# EAGLE design MTX_pic_piggyback_V13 (EAGLE 7.5.0)
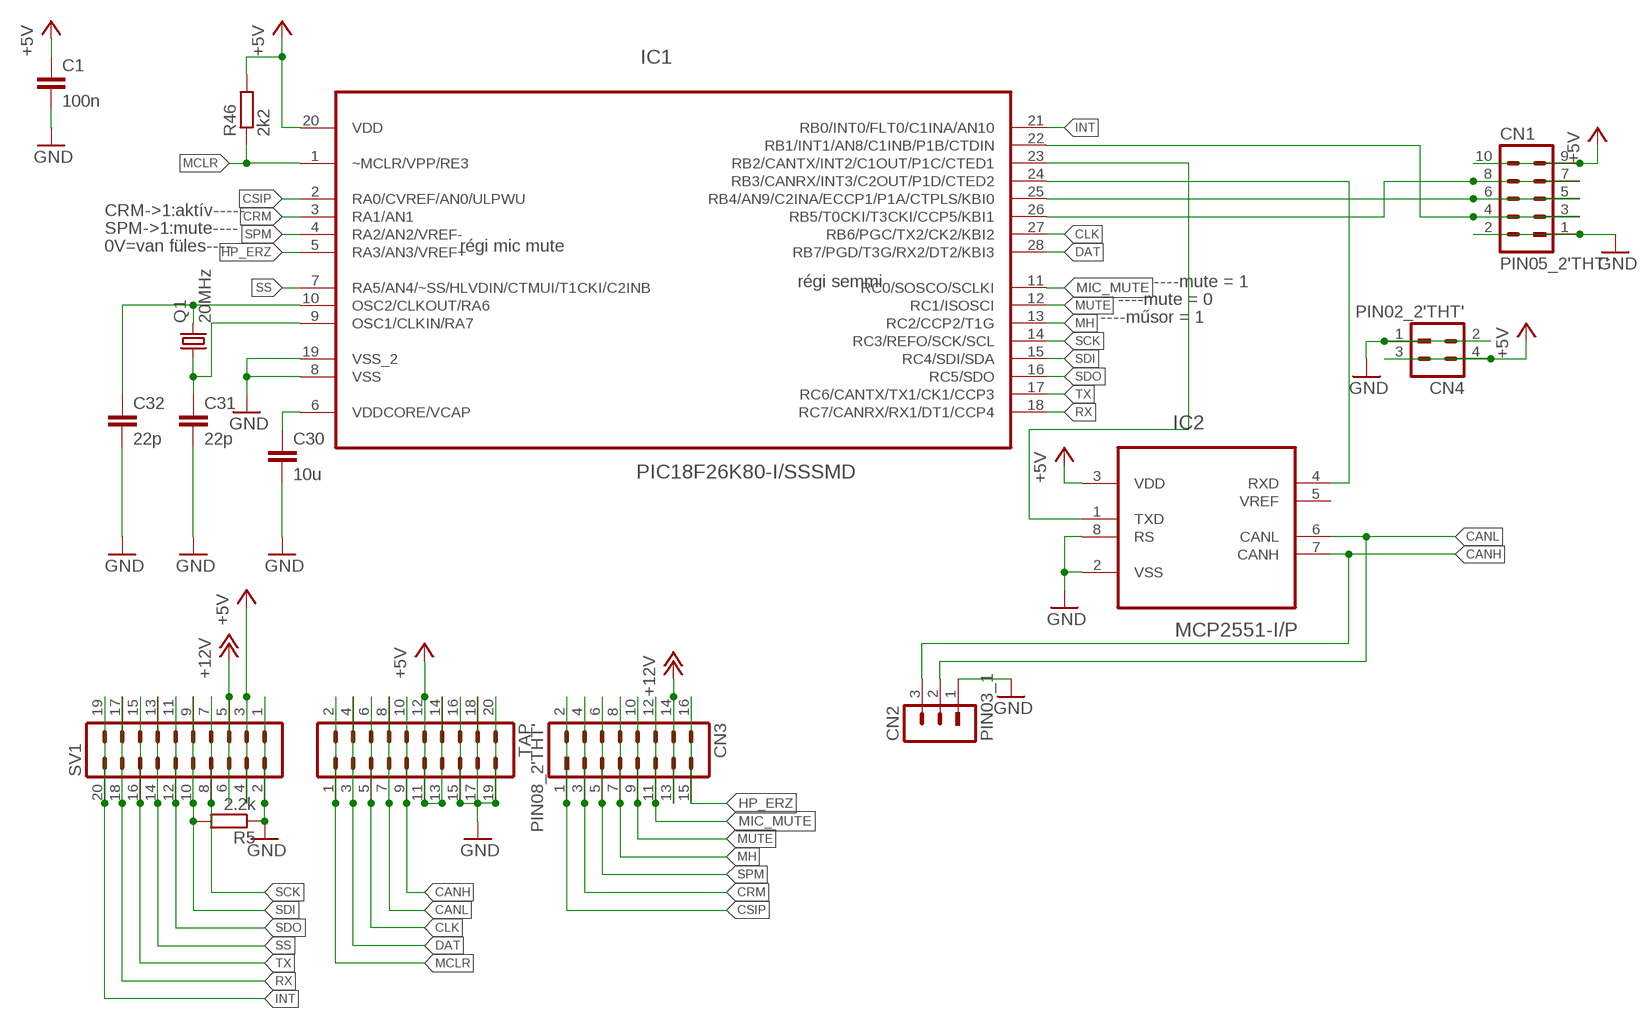
[diagram p0: schematic, sheet 1]

## Parts
C1  100n  C-EUC0805  [C0805]
C30  10u  C-EUC0805  [C0805]
C31  22p  C-EUC0805  [C0805]
C32  22p  C-EUC0805  [C0805]
CN1  PIN05_2'THT'  [PIN05_2]
CN2  PIN03_1  [PIN03_1]
CN3  PIN08_2'THT'  [PIN08_2]
CN4  PIN02_2'THT'  [PIN02_2]
IC1  PIC18F26K80-I/SSSMD  PIC18F25K80-I/SSSMD  [SOP65P780X200-28N]
IC2  MCP2551-I/P  [DIP254P762X432-8]
Q1  20MHz  XTAL_2QS  [XTAL_QS]
R5  2.2k  R-EU_R0805  [R0805]
R46  2k2  R-EU_R0805  [R0805]
SV1  MA10-2  [MA10-2]
TAP  MA10-2  [MA10-2]

## Nets
+5V: C1.1 CN1.9 CN1.10 CN4.3 CN4.4 IC1.20(VDD) IC2.3(VDD) R46.2 SV1.3 SV1.4 TAP.11 TAP.12 TAP.13 TAP.14
+12V: CN3.13 CN3.14 SV1.5 SV1.6
CANH: CN2.3 IC2.7(CANH) TAP.9 TAP.10
CANL: CN2.2 IC2.6(CANL) TAP.7 TAP.8
CLK: IC1.27(RB6/PGC/TX2/CK2/KBI2) TAP.5 TAP.6
CRM: CN3.3 CN3.4 IC1.3(RA1/AN1)
CSIP: CN3.1 CN3.2 IC1.2(RA0/CVREF/AN0/ULPWU)
DAT: IC1.28(RB7/PGD/T3G/RX2/DT2/KBI3) TAP.3 TAP.4
GND: C1.2 C30.2 C31.2 C32.2 CN1.1 CN1.2 CN2.1 CN4.1 CN4.2 IC1.8(VSS) IC1.19(VSS_2) IC2.2(VSS) IC2.8(RS) R5.1 SV1.1 SV1.2 TAP.15 TAP.16 TAP.17 TAP.18 TAP.19 TAP.20
HP_ERZ: CN3.15 CN3.16 IC1.5(RA3/AN3/VREF+)
INT: IC1.21(RB0/INT0/FLT0/C1INA/AN10) SV1.19 SV1.20
MCLR: IC1.1(~MCLR/VPP/RE3) R46.1 TAP.1 TAP.2
MH: CN3.7 CN3.8 IC1.13(RC2/CCP2/T1G)
MIC_MUTE: CN3.11 CN3.12 IC1.11(RC0/SOSCO/SCLKI)
MUTE: CN3.9 CN3.10 IC1.12(RC1/ISOSCI)
N$1: IC1.23(RB2/CANTX/INT2/C1OUT/P1C/CTED1) IC2.1(TXD)
N$3: CN1.7 CN1.8 IC1.26(RB5/T0CKI/T3CKI/CCP5/KBI1)
N$4: CN1.5 CN1.6 IC1.25(RB4/AN9/C2INA/ECCP1/P1A/CTPLS/KBI0)
N$5: CN1.3 CN1.4 IC1.22(RB1/INT1/AN8/C1INB/P1B/CTDIN)
N$57: C30.1 IC1.6(VDDCORE/VCAP)
N$58: C31.1 IC1.9(OSC1/CLKIN/RA7) Q1.1
N$59: C32.1 IC1.10(OSC2/CLKOUT/RA6) Q1.2
N$86: IC1.24(RB3/CANRX/INT3/C2OUT/P1D/CTED2) IC2.4(RXD)
RX: IC1.18(RC7/CANRX/RX1/DT1/CCP4) SV1.17 SV1.18
SCK: IC1.14(RC3/REFO/SCK/SCL) SV1.7 SV1.8
SDI: IC1.15(RC4/SDI/SDA) R5.2 SV1.9 SV1.10
SDO: IC1.16(RC5/SDO) SV1.11 SV1.12
SPM: CN3.5 CN3.6 IC1.4(RA2/AN2/VREF-)
SS: IC1.7(RA5/AN4/~SS/HLVDIN/CTMUI/T1CKI/C2INB) SV1.13 SV1.14
TX: IC1.17(RC6/CANTX/TX1/CK1/CCP3) SV1.15 SV1.16
Unconnected: IC2.5(VREF)

## Notes on the sheet
- CRM->1:aktív-----
- SPM->1:mute----
- 0V=van füles---- | régi mic mute
- régi semmi | ----mute = 1
- ----mute = 0
- ----műsor = 1

## Library data of the parts
C1 C30-C32 = rcl:C-EU: CAPACITOR, European symbol
CN1 = Cf_Csatl:PIN05_2
CN2 = Cf_Csatl:PIN03_1
CN3 = Cf_Csatl:PIN08_2
CN4 = Cf_Csatl:PIN02_2
IC1 = Microchip_By_element14_Batch_1:PIC18F25K80-I/SS
IC2 = Microchip_By_element14_Batch_1:MCP2551-I/P: High-Speed CAN Transceiver; DESCRIPTION: CAN CTRL; MPN: MCP2551-I/P; OC_FARNELL: 1292240; OC_NEWARK: 61K2947; PACKAGE: PDIP-8; SUPPLIER: Microchip
Q1 = Cf_RLCPX:XTAL_2
R5 R46 = rcl:R-EU_: RESISTOR, European symbol
SV1 TAP = con-lstb:MA10-2: PIN HEADER; OC_FARNELL: unknown; OC_NEWARK: unknown

## Board
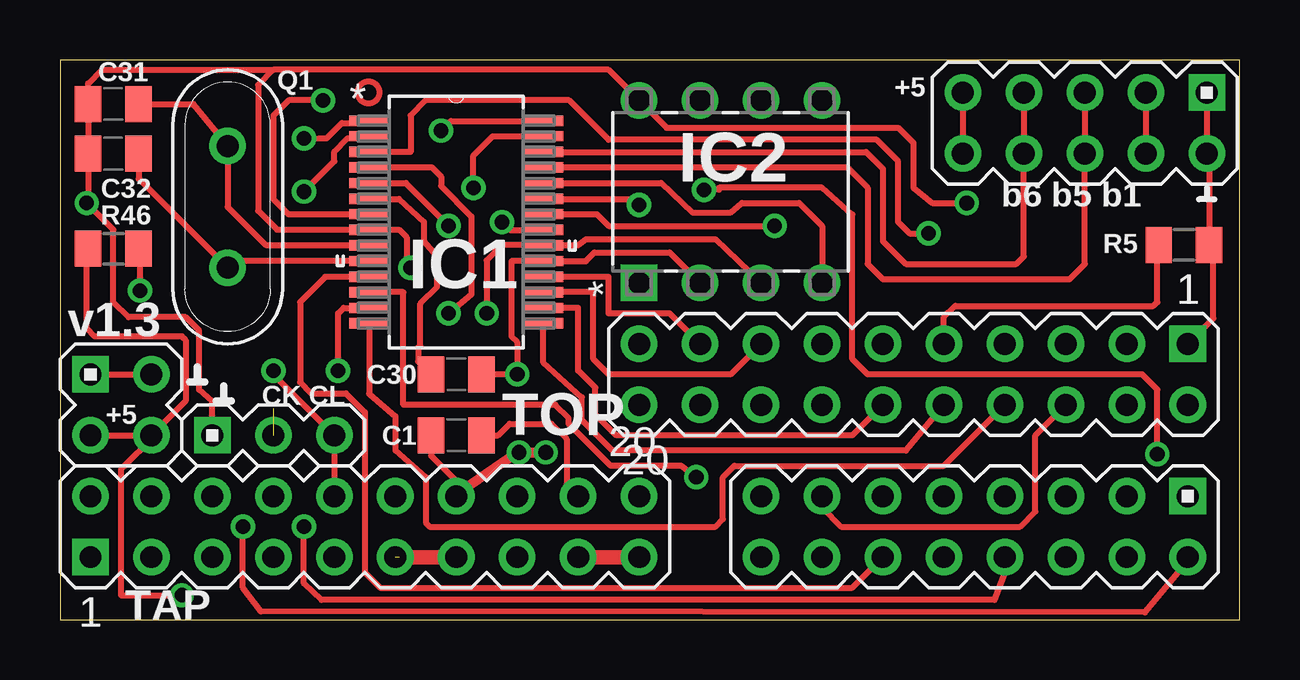
[diagram p1: board, top side]
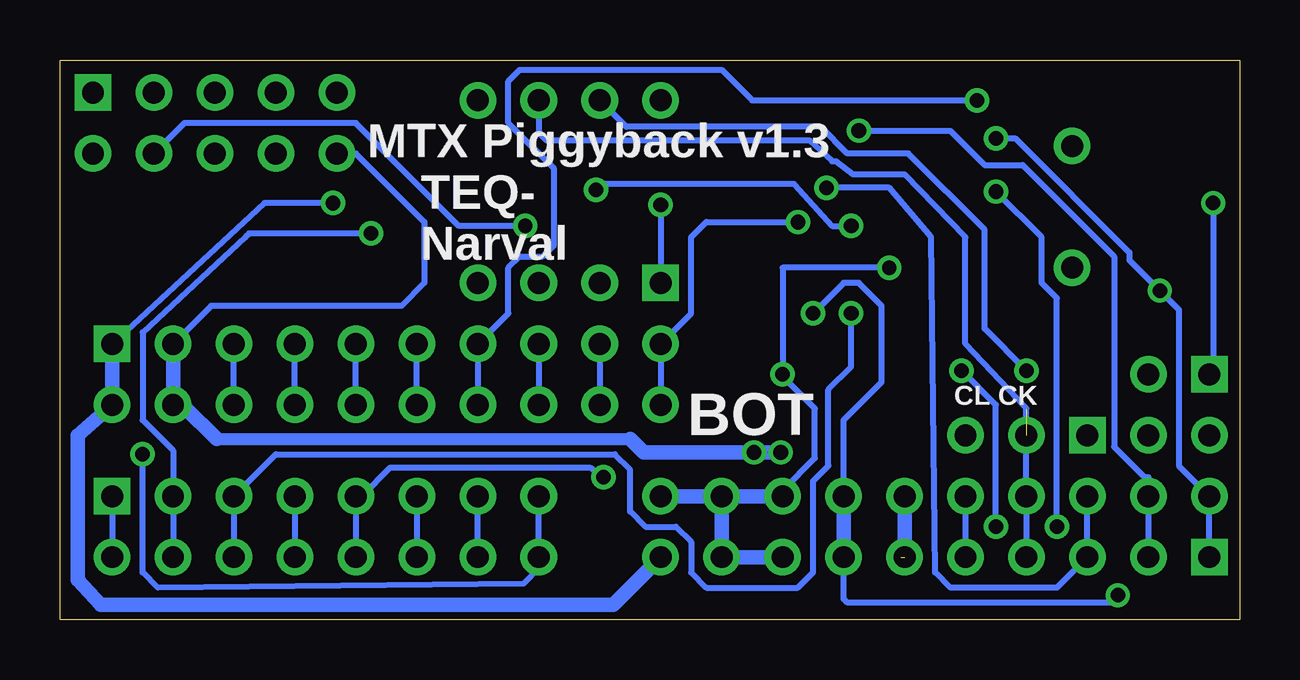
[diagram p2: board, bottom side, seen from below]

Size 49.16 x 23.35 mm. Coordinates in mm from the lower left corner, seen from the top.
Outline: 0,0 49.16,0 49.16,23.35 0,23.35 0,0
Copper layers (1*16): Top 0.035mm / dielectric 1.5mm / Bottom 0.035mm
Design rules "default": minimum track width 10mil, minimum drill 24mil, track to track 10mil, track to pad 10mil, pad to pad 10mil, via to via 10mil, smd to smd 10mil, copper to edge 10mil, drill to drill 10mil, minimum pad ring 10mil, minimum via ring 8mil, stop-mask expansion 4mil, vias tented up to drill 0mil, thermal gap 10mil

### Footprints (pad centres in the part's own frame; a part is rotated, then mirrored left to right if it is on the bottom)
C0805 = smd 1.1 x 1.5: 1 -1.05,0; 2 1.05,0
PIN05_2 = drill 0.914 pad 1.524 square: 1 -5.08,0 | drill 0.914 pad 1.524: 2 -5.08,2.54; 3 -2.54,0; 4 -2.54,2.54; 5 0,0; 6 0,2.54; 7 2.54,0; 8 2.54,2.54; 9 5.08,0; 10 5.08,2.54
PIN03_1 = drill 0.914 pad 1.524 square: 1 -2.54,0 | drill 0.914 pad 1.524: 2 0,0; 3 2.54,0
PIN08_2 = drill 0.914 pad 1.524 square: 1 -7.62,0 | drill 0.914 pad 1.524: 2 -7.62,2.54; 3 -5.08,0; 4 -5.08,2.54; 5 -2.54,0; 6 -2.54,2.54; 7 0,0; 8 0,2.54; 9 2.54,0; 10 2.54,2.54; 11 5.08,0; 12 5.08,2.54; 13 7.62,0; 14 7.62,2.54; 15 10.16,0; 16 10.16,2.54
PIN02_2 = drill 0.914 pad 1.524 square: 1 0,0 | drill 0.914 pad 1.524: 2 0,2.54; 3 2.54,0; 4 2.54,2.54
SOP65P780X200-28N = smd 1.651 x 0.432: 1 -3.632,4.216; 2 -3.632,3.581; 3 -3.632,2.921; 4 -3.632,2.286; 5 -3.632,1.626; 6 -3.632,0.965; 7 -3.632,0.33; 8 -3.632,-0.33; 9 -3.632,-0.965; 10 -3.632,-1.626; 11 -3.632,-2.286; 12 -3.632,-2.921; 13 -3.632,-3.581; 14 -3.632,-4.216; 15 3.632,-4.216; 16 3.632,-3.581; 17 3.632,-2.921; 18 3.632,-2.286; 19 3.632,-1.626; 20 3.632,-0.965; 21 3.632,-0.33; 22 3.632,0.33; 23 3.632,0.965; 24 3.632,1.626; 25 3.632,2.286; 26 3.632,2.921; 27 3.632,3.581; 28 3.632,4.216
DIP254P762X432-8 = drill 0.914 pad 1.524 square: 1 -3.81,3.81 | drill 0.914 pad 1.524: 2 -3.81,1.27; 3 -3.81,-1.27; 4 -3.81,-3.81; 5 3.81,-3.81; 6 3.81,-1.27; 7 3.81,1.27; 8 3.81,3.81
XTAL_QS = drill 0.914 pad 1.524: 1 -2.54,0; 2 2.54,0
R0805 = smd 1.1 x 1.5: 1 -1.05,0; 2 1.05,0
MA10-2 = drill 0.914 pad 1.524 square: 1 -11.43,-1.27 | drill 0.914 pad 1.524: 2 -11.43,1.27; 3 -8.89,-1.27; 4 -8.89,1.27; 5 -6.35,-1.27; 6 -6.35,1.27; 7 -3.81,-1.27; 8 -3.81,1.27; 9 -1.27,-1.27; 10 -1.27,1.27; 11 1.27,-1.27; 12 1.27,1.27; 13 3.81,-1.27; 14 3.81,1.27; 15 6.35,-1.27; 16 6.35,1.27; 17 8.89,-1.27; 18 8.89,1.27; 19 11.43,-1.27; 20 11.43,1.27

### Placement (x,y rotation side)
C1  16.51,7.7 0 top
C30  16.51,10.24 0 top
C31  2.22,21.51 180 top
C32  2.22,19.45 180 top
CN1  42.7,21.99 180 top
CN2  8.89,7.7 0 top
CN3  39.37,5.16 180 top
CN4  1.27,10.24 270 top
IC1  16.51,16.59 0 top
IC2  27.94,17.86 90 top
Q1  6.99,17.22 270 top
R5  46.83,15.64 180 top
R46  2.22,15.48 180 top
SV1  35.56,10.24 180 top
TAP  12.7,3.89 0 top

### Tracks (layer width: path | path; a pad name or v marks a point on that pad's centre or on a via)
+5V  (via drill 0.6, 0.61, 0.61 pad 1.02)  (1 unrouted)
  Top 0.254: IC2.3 27.3,15.88 21.92,15.88 21.59,15.62 IC1.20 18.41,15.62 17.78,14.99 v17.78,12.78 | CN1.9 CN1.10 | CN4.3 CN4.4 | CN4.4 3.97,7.7 2.54,6.27 2.54,1.03 v5.08,1.03 | C1.1 15.46,6.84 16.51,5.79 TAP.14 | 1.17,15.42 R46.2 1.11,15.42 1.11,12.14 1.43,11.83 5.08,11.83 5.24,11.67 5.24,9.13 CN4.4
  Top 0.406: 16.51,5.24 19.05,6.99 v20.24,6.99
  Top 0.61: TAP.14 16.51,5.24 | 14.13,2.62 TAP.13
  Bottom 0.254: TAP.14 16.51,8.33 14.92,9.92 14.92,13.1 15.88,14.05 16.51,14.05 v17.78,12.78 | CN1.10 36.83,19.45 33.97,16.59 33.97,14.05 34.92,13.1 42.86,13.1 SV1.3 | TAP.13 16.51,0.87 16.35,0.71 5.4,0.71 v5.08,1.03
  Bottom 0.508: 42.62,7.54 25.4,7.54
  Bottom 0.61: SV1.3 SV1.4 43.97,8.89 42.62,7.54 | TAP.14 TAP.13 | TAP.12 TAP.11 | 25.4,7.54 24.84,6.99 v20.24,6.99 v19.13,6.99 18.97,6.99
+12V
  Top 0.254: SV1.6 40.72,7.78 40.64,7.7 40.64,4.52 40.01,3.89 32.54,3.89 31.75,4.68 CN3.13
  Bottom 0.254: SV1.6 SV1.5 | CN3.14 CN3.13
CANH  (via drill 0.61 pad 1.02)
  Top 0.254: v8.89,10.4 8.89,10.24 CN2.3 TAP.10
  Bottom 0.254: TAP.10 TAP.9 | v8.89,10.4 10.64,12.14 10.64,16.27 13.81,19.45 16.35,19.45 17.46,20.56 25.56,20.56 IC2.7
CANL  (1 unrouted)
  Bottom 0.254: TAP.7 TAP.8 8.89,8.81 11.43,11.51 11.43,15.95 13.97,18.57 16.11,18.57 16.83,19.13 16.99,19.13 17.94,20 28.89,20 29.21,20.32 IC2.6
CLK  (via drill 0.61 pad 1.02)
  Top 0.254: v17.22,18.02 17.22,19.37 18.03,20.17 IC1.27
  Bottom 0.254: v17.22,18.02 14.61,18.02 12.86,15.95 12.7,1.98 12.06,1.35 7.62,1.35 TAP.5 TAP.6
CRM  (via drill 0.61 pad 1.02)
  Top 0.254: IC1.3 14.61,19.51 14.61,21.03 15.24,21.67 21.21,21.67 22.86,20.02 34.04,20.02 34.92,19.13 34.92,16.59 35.4,16.11 v36.2,16.11
  Bottom 0.254: v36.2,16.11 41.27,16.11 41.43,15.95 45.72,11.99 45.72,8.33 44.45,7.06 CN3.3 CN3.4
CSIP  (via drill 0.61 pad 1.02)
  Top 0.254: v10.16,17.86 11.43,19.13 11.43,19.54 11.98,20.08 12.06,20.08 IC1.2 | v7.62,3.89 7.62,1.35 8.37,0.36 45.2,0.32 46.99,2.46 CN3.2
  Bottom 0.254: CN3.1 CN3.2 | v7.62,3.89 7.62,13.41 8.26,14.05 8.26,15.95 v10.16,17.86
DAT  (via drill 0.61 pad 1.02)
  Top 0.254: v15.88,20.4 16.28,20.81 IC1.28
  Bottom 0.254: TAP.3 TAP.4 3.81,5.95 3.97,5.95 5.24,7.22 5.24,15.16 9.05,18.97 10.64,18.97 12.06,20.4 v15.88,20.4
GND  (via drill 0.6, 0.61 pad 1.02)
  Top 0.254: 8.89,22.94 22.86,22.94 IC2.8 25.27,20.53 34.92,20.53 35.56,19.89 35.56,18.02 36.35,17.38 v37.78,17.38 | 8.89,22.94 8.26,22.3 8.26,17.07 9.05,16.27 12.87,16.27 | SV1.1 48.05,12.57 48.05,15.94 R5.1 | IC2.2 25.4,15.32 22.26,15.32 21.91,14.96 IC1.19 18.8,14.96 18.8,11.83 19.05,11.58 v19.05,10.24 C30.2 | 47.78,16.21 R5.1 | CN1.1 CN1.2 47.88,19.45 R5.1 | 12.87,16.27 IC1.8 | 8.89,22.94 1.75,22.94 1.17,22.37 C31.2 C32.2 1.17,17.44 v1.11,17.38 2.22,16.27 2.22,13.26 2.86,12.62 5.24,12.62 5.79,12.07 5.79,9.6 6.35,9.13 CN2.1 | CN4.2 CN4.1 1.17,10.34 | C1.2 18.26,7.7 18.73,8.18 20.48,8.18 21.11,7.54 21.11,5.64 TAP.18 | 12.87,16.27 14.13,16.27 14.45,15.95 14.45,14.84 v14.61,14.68
  Top 0.61: TAP.17 TAP.19 24.35,2.84
  Bottom 0.254: TAP.16 19.05,5.4 17.7,6.75 17.7,8.81 19.05,10.16 v19.05,10.24 19.05,14.68 v14.61,14.68 | v37.78,17.38 40.64,17.38 SV1.1 | v1.11,17.38 1.11,10.4 CN4.1
  Bottom 0.61: TAP.15 TAP.17 TAP.18 | TAP.18 TAP.20 | TAP.16 TAP.18 | SV1.1 SV1.2 48.42,7.7 48.42,1.67 47.47,0.64 26.11,0.64 TAP.19
HP_ERZ  (via drill 0.61 pad 1.02)
  Top 0.254: v45.72,6.91 45.72,9.6 45.09,10.24 33.66,10.24 33.02,10.87 33.02,16.91 31.75,18.02 27.46,18.02 27.46,17.94 v26.83,17.94 | IC1.5 14.41,18.22 v16.19,16.43
  Bottom 0.254: v45.72,6.91 45.72,1.98 45.09,1.35 29.84,1.51 29.21,2.14 CN3.16 CN3.15 | v16.19,16.43 16.99,16.43 18.57,18.18 26.67,18.18 v26.83,17.94
INT  (via drill 0.61 pad 1.02)
  Top 0.254: v18.41,16.59 18.75,16.26 IC1.21
  Bottom 0.254: v18.41,16.59 22.23,16.59 22.86,15.95 22.86,12.78 SV1.19 SV1.20
MCLR  (via drill 0.6, 0.61 pad 1.02)
  Top 0.254: v10.16,20.08 10.16,20.01 10.79,20.08 11.11,20.08 11.75,20.72 12.79,20.72 IC1.1 | R46.1 3.33,15.42 v3.33,13.73 3.49,13.89
  Bottom 0.254: TAP.1 TAP.2 2.54,6.43 2.54,12.94 v3.33,13.73 4.6,15 4.6,15.32 9.37,20.08 v10.16,20.08
MH  (via drill 0.61 pad 1.02)
  Top 0.254: v11.59,10.4 11.59,12.78 11.82,13.01 IC1.13 | v10.16,3.89 10.16,1.52 10.89,0.83 38.93,0.83 39.37,1.98 CN3.8
  Bottom 0.254: v10.16,3.89 10.16,8.97 v11.59,10.4 | CN3.7 CN3.8
MIC_MUTE
  Top 0.254: IC1.11 11.05,14.3 10,13.26 10,9.92 10.48,9.45 11.91,9.45 12.7,8.65 12.7,1.98 13.34,1.35 33.02,1.35 CN3.12
  Bottom 0.254: CN3.11 CN3.12
MUTE  (via drill 0.61 pad 1.02)
  Top 0.254: v26.51,5.95 25.88,6.43 22.94,6.43 21.19,8.18 21.19,8.41 20.64,8.97 14.31,8.97 14.31,13.67 IC1.12
  Bottom 0.254: v26.51,5.95 27.07,6.35 35.4,6.35 36.59,5.16 CN3.9 CN3.10
N$1  (via drill 0.61 pad 1.02)
  Top 0.254: IC1.23 23.96,17.55 v24.13,17.3
  Bottom 0.254: v24.13,17.3 IC2.1
N$3
  Top 0.254: IC1.26 33.59,19.51 34.29,18.81 34.29,15.8 35.24,14.84 39.85,14.84 40.16,15.16 CN1.8 CN1.7
N$4
  Top 0.254: IC1.25 32.8,18.88 33.66,18.02 33.66,14.84 34.29,14.21 42.07,14.21 42.7,14.84 CN1.6 CN1.5
N$5  (via drill 0.6)
  Top 0.254: IC1.22 22.37,16.92 22.86,16.43 v29.77,16.43 | CN1.3 CN1.4
  Bottom 0.254: v29.77,16.43 32.54,16.43 36.83,20.72 43.97,20.72 CN1.4
N$57
  Top 0.254: C30.1 14.92,10.78 14.92,11.35 15.01,11.42 15.01,13.19 15.72,13.89 15.72,15.16 15.16,15.8 15.16,16.59 14.12,17.55 IC1.6 | C30.1
N$58
  Top 0.254: C31.1 5.56,21.51 Q1.1 6.99,17.22 8.57,15.64 12.87,15.64 IC1.9
N$59
  Top 0.254: C32.1 3.27,18.4 Q1.2 7.26,14.96 IC1.10
N$86
  Top 0.254: IC1.24 25.04,18.22 26.35,16.99 27.94,16.99 28.42,17.38 30.8,17.38 31.75,16.43 IC2.4
RX
  Top 0.254: SV1.17 25.4,12.78 22.86,12.78 22.86,14.3 IC1.18
  Bottom 0.254: SV1.17 SV1.18
SCK
  Top 0.254: 12.7,12.3 IC1.14 12.88,9.43 13.97,8.49 13.97,7.06 15.24,5.95 15.24,4.05 15.4,3.89 27.3,3.89 27.62,4.21 27.62,5.95 28.1,6.43 36.83,6.43 SV1.8
  Bottom 0.254: SV1.8 SV1.7
SDI
  Top 0.254: SV1.10 35.24,7.06 23.02,7.06 21.75,8.33 21.75,9.29 20.14,10.73 IC1.15 | SV1.9 36.83,12.62 37.31,13.1 45.56,13.1 45.72,13.26 45.72,16.05 R5.2
  Bottom 0.254: SV1.10 SV1.9
SDO
  Top 0.254: SV1.12 33.02,7.7 23.18,7.7 22.3,8.57 22.3,9.68 21.59,10.4 21.59,13.01 IC1.16
  Bottom 0.254: SV1.12 SV1.11
SPM  (via drill 0.61 pad 1.02)
  Top 0.254: IC1.4 15.49,18.88 15.88,18.49 15.88,18.1 17.14,16.83 17.14,13.57 v16.19,12.78
  Bottom 0.254: v16.19,12.78 16.19,10.56 17.14,9.6 17.14,6.43 17.78,5.79 17.78,1.98 18.41,1.35 22.23,1.35 22.86,1.98 22.86,3.25 23.5,3.89 24.77,3.89 25.4,4.52 25.4,6.27 26.04,6.91 40.16,6.91 CN3.5 CN3.6
SS  (via drill 0.61 pad 1.02)
  Top 0.254: v10.95,21.67 9.53,21.67 8.89,21.03 8.89,17.54 9.51,16.92 IC1.7
  Bottom 0.254: v10.95,21.67 20.32,21.67 21.59,22.94 30,22.94 30.48,22.46 30.48,20.72 28.57,18.81 28.57,15.64 29.05,15.16 30,15.16 30.48,14.68 30.48,12.78 SV1.13 SV1.14
TX
  Top 0.254: SV1.15 27.94,10.24 22.86,10.24 22.23,10.87 22.23,13.67 IC1.17
  Bottom 0.254: SV1.15 SV1.16
(copper drawn outside any net)
  shapes: Top circle x1

### Text on the board
tNames: +5 | b6 b5 b1 | v1.3 | CK CL | +5 | TOP
bNames: MTX Piggyback v1.3 | TEQ- / Narval | CL CK | BOT
tTest: RX | TX | SS | SDO | SDI | CLK | 12V | 5V | INT